# Altium project rocket_flight_logger_utilequ_pcb.PrjPcb
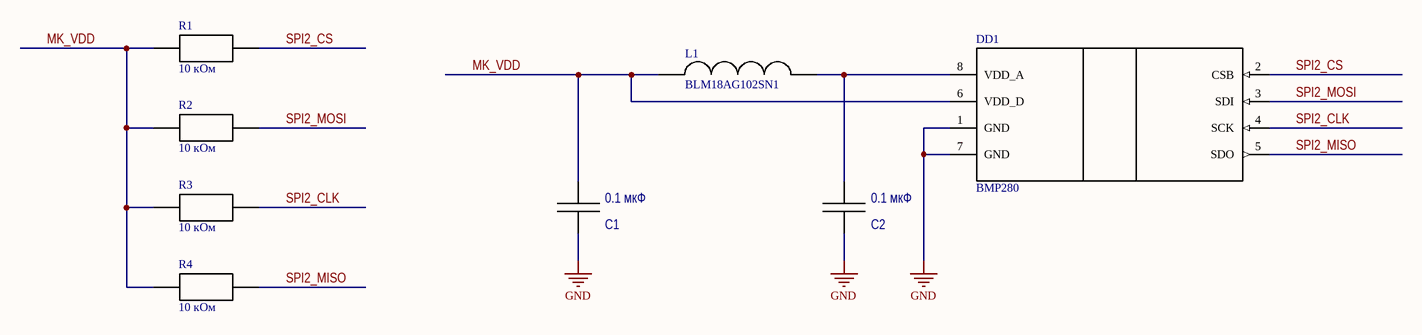
[diagram p0: BMP280.SchDoc]
8 sheets, 86 parts. Net scope: global (net labels, ports and power ports of the same name join across sheets).
Board file: main.PcbDoc
Sheets:
  BMP280.SchDoc
  CONNECT.SchDoc
  ESP12E.SchDoc
  FLASH.SchDoc
  MPU6050.SchDoc
  POWER.SchDoc
  PP.SchDoc
  STM32.SchDoc

## Sheet BMP280.SchDoc
size A4

### Parts
C1  0.1 мкФ  [C 1206]
C2  0.1 мкФ  [C 1206]
DD1  BMP280  [LGA_2.0_2.5_8PIN]
L1  BLM18AG102SN1  [FB 0603]
R1  10 кОм  [RES 0805]
R2  10 кОм  [RES 0805]
R3  10 кОм  [RES 0805]
R4  10 кОм  [RES 0805]

### Nets
GND: C1.2 C2.2 DD1.1(GND) DD1.7(GND)
MK_VDD: C1.1 DD1.6(VDD_D) L1.1 R1.1 R2.1 R3.1 R4.1
SPI2_CLK: DD1.4(SCK) R3.2
SPI2_CS: DD1.2(CSB) R1.2
SPI2_MISO: DD1.5(SDO) R4.2
SPI2_MOSI: DD1.3(SDI) R2.2
NetC2_1: C2.1 DD1.8(VDD_A) L1.2

### Library data of the parts
C1 C2 = CAP 1206: SMD Capacitor 1206; Manufacturer: /Укажите компанию-производителя/; Tolerance: /Укажите допуск в процентах/; Temperature coefficient: /Формат: ±? ppm/°C/; Type: Конденсатор керамический; TC: /Укажите тип диэлектрика/; Size: 1206; Temperature range: /Формат: -? ... ? °C/; Value: 0.1 мкФ
R1-R4 = RES 0805

## Sheet CONNECT.SchDoc
size A4
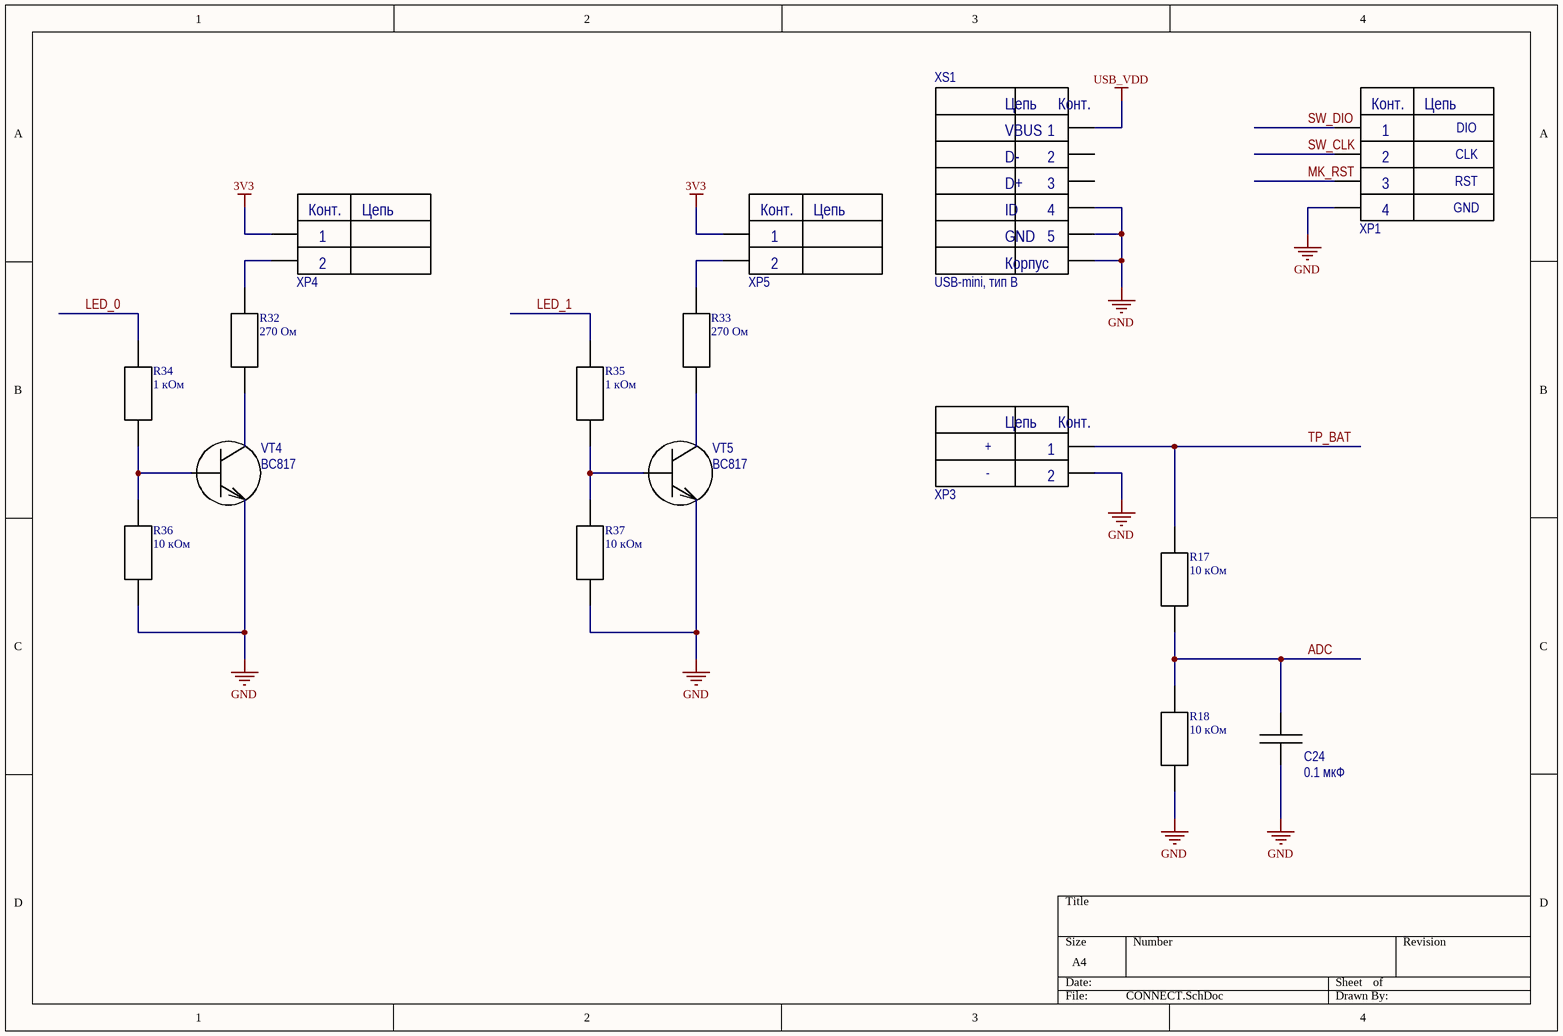
[diagram p1: CONNECT.SchDoc]

### Parts
C24  0.1 мкФ  [C 1206]
R17  10 кОм  [RES 0805]
R18  10 кОм  [RES 0805]
R32  270 Ом  [RES 0805]
R33  270 Ом  [RES 0805]
R34  1 кОм  [RES 0805]
R35  1 кОм  [RES 0805]
R36  10 кОм  [RES 0805]
R37  10 кОм  [RES 0805]
VT4  BC817  [SOT-23]
VT5  BC817  [SOT-23]
XP1  PLD-4  [PLD-4]  (value not drawn)
XP3  PLS-2  [PLS-2]  (value not drawn)
XP4  PLS-2  [PLS-2]  (value not drawn)
XP5  PLS-2  [PLS-2]  (value not drawn)
XS1  USB-mini, тип B  [USB_mini_B]

### Nets
3V3: XP4.1 XP5.1
GND: C24.2 R18.1 R36.2 R37.2 VT4.2(E) VT5.2(E) XP1.4 XP3.2 XS1.0 XS1.4(CASE) XS1.5(GND)
USB_VDD: XS1.1(VBUS)
ADC: C24.1 R17.1 R18.2
LED_0: R34.1
LED_1: R35.1
MK_RST: XP1.3
SW_CLK: XP1.2
SW_DIO: XP1.1
TP_BAT: R17.2 XP3.1
NetR32_1: R32.1 XP4.2
NetR32_2: R32.2 VT4.3(C)
NetR33_1: R33.1 XP5.2
NetR33_2: R33.2 VT5.3(C)
NetR34_2: R34.2 R36.1 VT4.1(B)
NetR35_2: R35.2 R37.1 VT5.1(B)

Not connected (* = marked no-connect by the designer): XS1 2(D-) 3(D+)

### Notes on the sheet
- DIO
- CLK
- RST
- GND
- +
- -
- (in symbol PLD-4) Конт.; Цепь
- (in symbol PLS-2) Цепь; Конт.
- (in symbol USB-mini_B) Цепь; Конт.; ID; Корпус

### Library data of the parts
C24 = CAP 1206: as C1 on sheet BMP280; Size: 1206; Temperature range: /Формат: -? ... ? °C/; Value: 0.1 мкФ
R17 R18 R32-R37 = RES 0805
VT4 VT5 = BC817: NPN general-purpose transistor; Manufacturer: NXP; Structure: n-p-n; Type: Транзистор биполярный; hFE: 160 ... 600; Max collector-emitter voltage: 45 В; Max collector-base voltage: 50 В; Max emitter-base voltage: 5 В; Max collector current: 0,5 А; Max collector peak current: 1 А; Power dissitipation: 0,25 Вт; fT: 100 МГц; Collector-emitter saturation voltage: 0,7 В; Base-emitter on voltage: 1,2 В; Specitication: ЭКБ ИП; Collector-base сapacitance: 3 пФ; Complement: BC807; Temperature range: -65 ... 150 °C
XP1 = PLD-4: PLD connector; Manufacturer: NONAME; Connector type: Вилка на плату; Number of contacts: 4; Type: Разъем штыревой
XP3-XP5 = PLS-2: PLS connector; Manufacturer: NONAME; Connector type: Вилка на плату; Number of contacts: 2; Type: Разъем штыревой
XS1 = USB-mini_B: USB-mini-B connector; Manufacturer: NONAME; Connector type: USB-mini, тип B на плату; Number of contacts: 5; Type: Разъем

## Sheet ESP12E.SchDoc
size A4
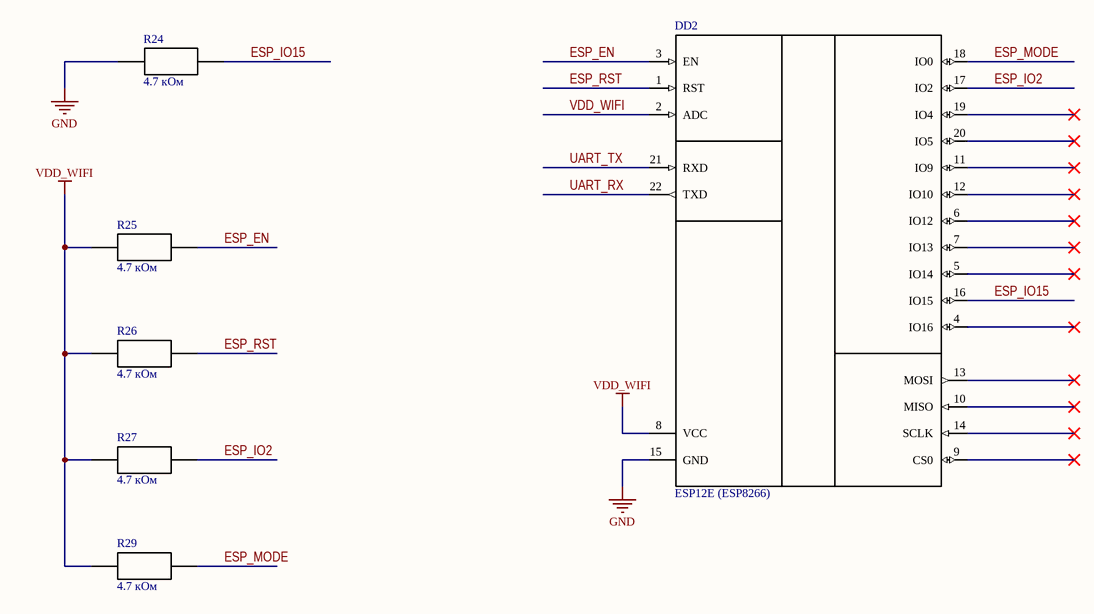
[diagram p2: ESP12E.SchDoc]

### Parts
DD2  ESP12E (ESP8266)  [ESP-12E]
R24  4.7 кОм  [RES 0805]
R25  4.7 кОм  [RES 0805]
R26  4.7 кОм  [RES 0805]
R27  4.7 кОм  [RES 0805]
R29  4.7 кОм  [RES 0805]

### Nets
GND: DD2.15(GND) R24.2
VDD_WIFI: DD2.2(ADC) DD2.8(VCC) R25.2 R26.2 R27.2 R29.2
ESP_EN: DD2.3(EN) R25.1
ESP_IO2: DD2.17(IO2) R27.1
ESP_IO15: DD2.16(IO15) R24.1
ESP_MODE: DD2.18(IO0) R29.1
ESP_RST: DD2.1(RST) R26.1
UART_RX: DD2.22(TXD)
UART_TX: DD2.21(RXD)

Not connected (* = marked no-connect by the designer): DD2 4(IO16)* 5(IO14)* 6(IO12)* 7(IO13)* 9(CS0)* 10(MISO)* 11(IO9)* 12(IO10)* 13(MOSI)* 14(SCLK)* 19(IO4)* 20(IO5)*

### Library data of the parts
R24-R27 R29 = RES 0805

## Sheet FLASH.SchDoc
size A4
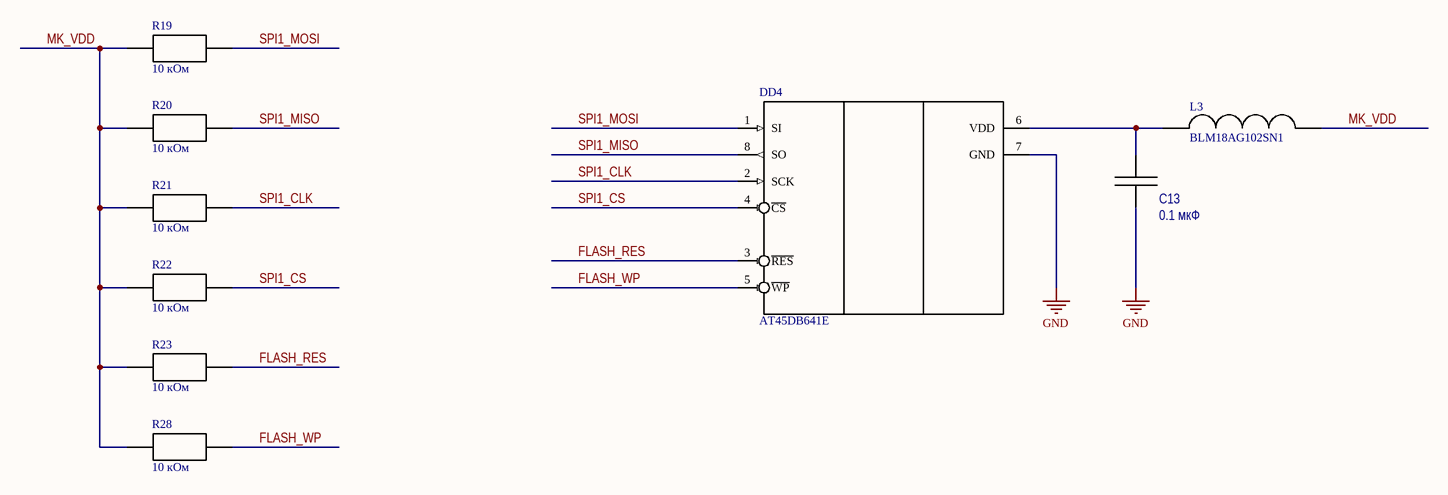
[diagram p3: FLASH.SchDoc]

### Parts
C13  0.1 мкФ  [C 1206]
DD4  AT45DB641E  [SOIC127P800X216-8N]
L3  BLM18AG102SN1  [FB 0603]
R19  10 кОм  [RES 0805]
R20  10 кОм  [RES 0805]
R21  10 кОм  [RES 0805]
R22  10 кОм  [RES 0805]
R23  10 кОм  [RES 0805]
R28  10 кОм  [RES 0805]

### Nets
GND: C13.2 DD4.7(GND)
MK_VDD: L3.2 R19.1 R20.1 R21.1 R22.1 R23.1 R28.1
FLASH_RES: DD4.3(~{RES}) R23.2
FLASH_WP: DD4.5(~{WP}) R28.2
SPI1_CLK: DD4.2(SCK) R21.2
SPI1_CS: DD4.4(~{CS}) R22.2
SPI1_MISO: DD4.8(SO) R20.2
SPI1_MOSI: DD4.1(SI) R19.2
NetC13_1: C13.1 DD4.6(VDD) L3.1

### Library data of the parts
C13 = CAP 1206: as C1 on sheet BMP280; Size: 1206; Temperature range: /Формат: -? ... ? °C/; Value: 0.1 мкФ
R19-R23 R28 = RES 0805

## Sheet MPU6050.SchDoc
size A4
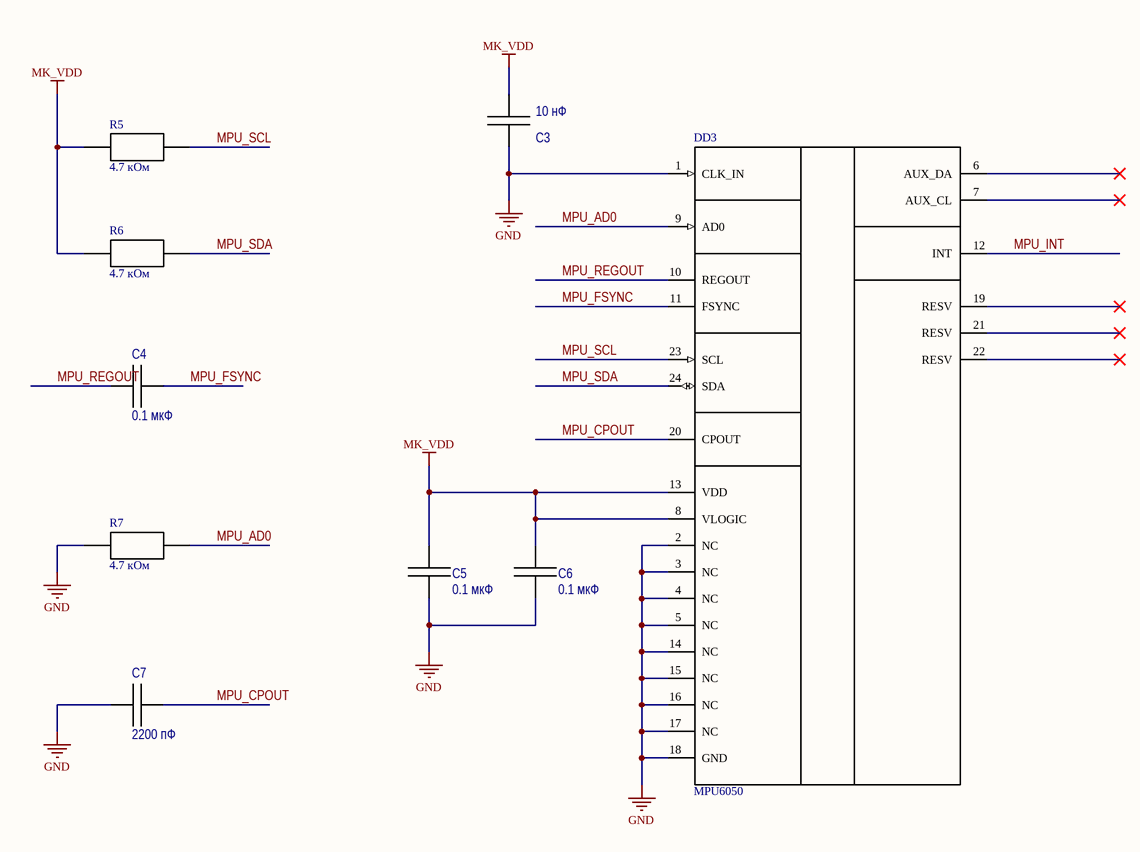
[diagram p4: MPU6050.SchDoc]

### Parts
C3  10 нФ  [C 1206]
C4  0.1 мкФ  [C 1206]
C5  0.1 мкФ  [C 1206]
C6  0.1 мкФ  [C 1206]
C7  2200 пФ  [C 1206]
DD3  MPU6050  [QFN50P400X400X95_HS-25N]
R5  4.7 кОм  [RES 0805]
R6  4.7 кОм  [RES 0805]
R7  4.7 кОм  [RES 0805]

### Nets
GND: C3.1 C5.2 C6.2 C7.1 DD3.1(CLK_IN) DD3.2(NC) DD3.3(NC) DD3.4(NC) DD3.5(NC) DD3.14(NC) DD3.15(NC) DD3.16(NC) DD3.17(NC) DD3.18(GND) R7.2
MK_VDD: C3.2 C5.1 C6.1 DD3.8(VLOGIC) DD3.13(VDD) R5.2 R6.2
MPU_AD0: DD3.9(AD0) R7.1
MPU_CPOUT: C7.2 DD3.20(CPOUT)
MPU_FSYNC: C4.2 DD3.11(FSYNC)
MPU_INT: DD3.12(INT)
MPU_REGOUT: C4.1 DD3.10(REGOUT)
MPU_SCL: DD3.23(SCL) R5.1
MPU_SDA: DD3.24(SDA) R6.1

Not connected (* = marked no-connect by the designer): DD3 6(AUX_DA)* 7(AUX_CL)* 19(RESV)* 21(RESV)* 22(RESV)*

### Library data of the parts
C3-C7 = CAP 1206: as C1 on sheet BMP280; Size: 1206; Temperature range: /Формат: -? ... ? °C/
R5-R7 = RES 0805

## Sheet POWER.SchDoc
size A4
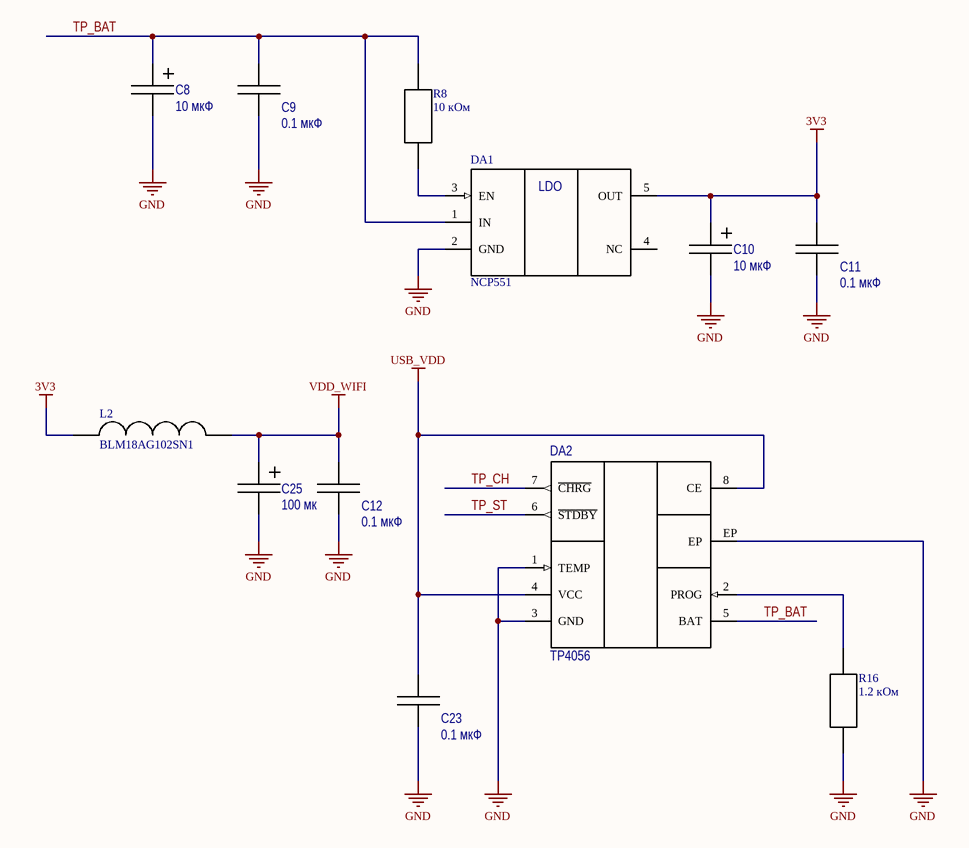
[diagram p5: POWER.SchDoc]

### Parts
C8  10 мкФ  [C TAN_C]
C9  0.1 мкФ  [C 1206]
C10  10 мкФ  [C TAN_C]
C11  0.1 мкФ  [C 1206]
C12  0.1 мкФ  [C 1206]
C23  0.1 мкФ  [C 1206]
C25  value 100 мк  [C TAN_D]
DA1  NCP551  [TSOP-5]
DA2  TP4056  [HSOP-8]
L2  BLM18AG102SN1  [FB 0603]
R8  10 кОм  [RES 0805]
R16  1.2 кОм  [RES 0805]

### Nets
3V3: C10.1 C11.1 DA1.5(OUT) L2.1
GND: C8.2 C9.2 C10.2 C11.2 C12.2 C23.2 C25.2 DA1.2(GND) DA2.1(TEMP) DA2.3(GND) DA2.EP R16.1
USB_VDD: C23.1 DA2.4(VCC) DA2.8(CE)
VDD_WIFI: C12.1 C25.1 L2.2
TP_BAT: C8.1 C9.1 DA1.1(IN) DA2.5(BAT) R8.2
TP_CH: DA2.7(~{CHRG})
TP_ST: DA2.6(~{STDBY})
NetDA1_3: DA1.3(EN) R8.1
NetDA2_2: DA2.2(PROG) R16.2

Not connected (* = marked no-connect by the designer): DA1 4(NC)

### Notes on the sheet
- (in symbol NCP551) LDO

### Library data of the parts
C8 C10 = CAP TAN_C: SMD Tantalium Capacitor C; Manufacturer: /Укажите компанию-производителя/; Tolerance: /Укажите допуск в процентах/; Type: Конденсатор танталовый; ESR: /Укажите значение ЭПС/; Size: C; Temperature range: /Формат: -? ... ? °C/; Value: 10 мкФ
C9 C11 C12 C23 = CAP 1206: as C1 on sheet BMP280; Size: 1206; Temperature range: /Формат: -? ... ? °C/; Value: 0.1 мкФ
C25 = CAP TAN_D: SMD Tantalium Capacitor D; Manufacturer: /Укажите компанию-производителя/; Tolerance: /Укажите допуск в процентах/; Type: Конденсатор танталовый; ESR: /Укажите значение ЭПС/; Rated voltage: 10 В; Size: D; Temperature range: /Формат: -? ... ? °C/
R8 R16 = RES 0805

## Sheet PP.SchDoc
size A4
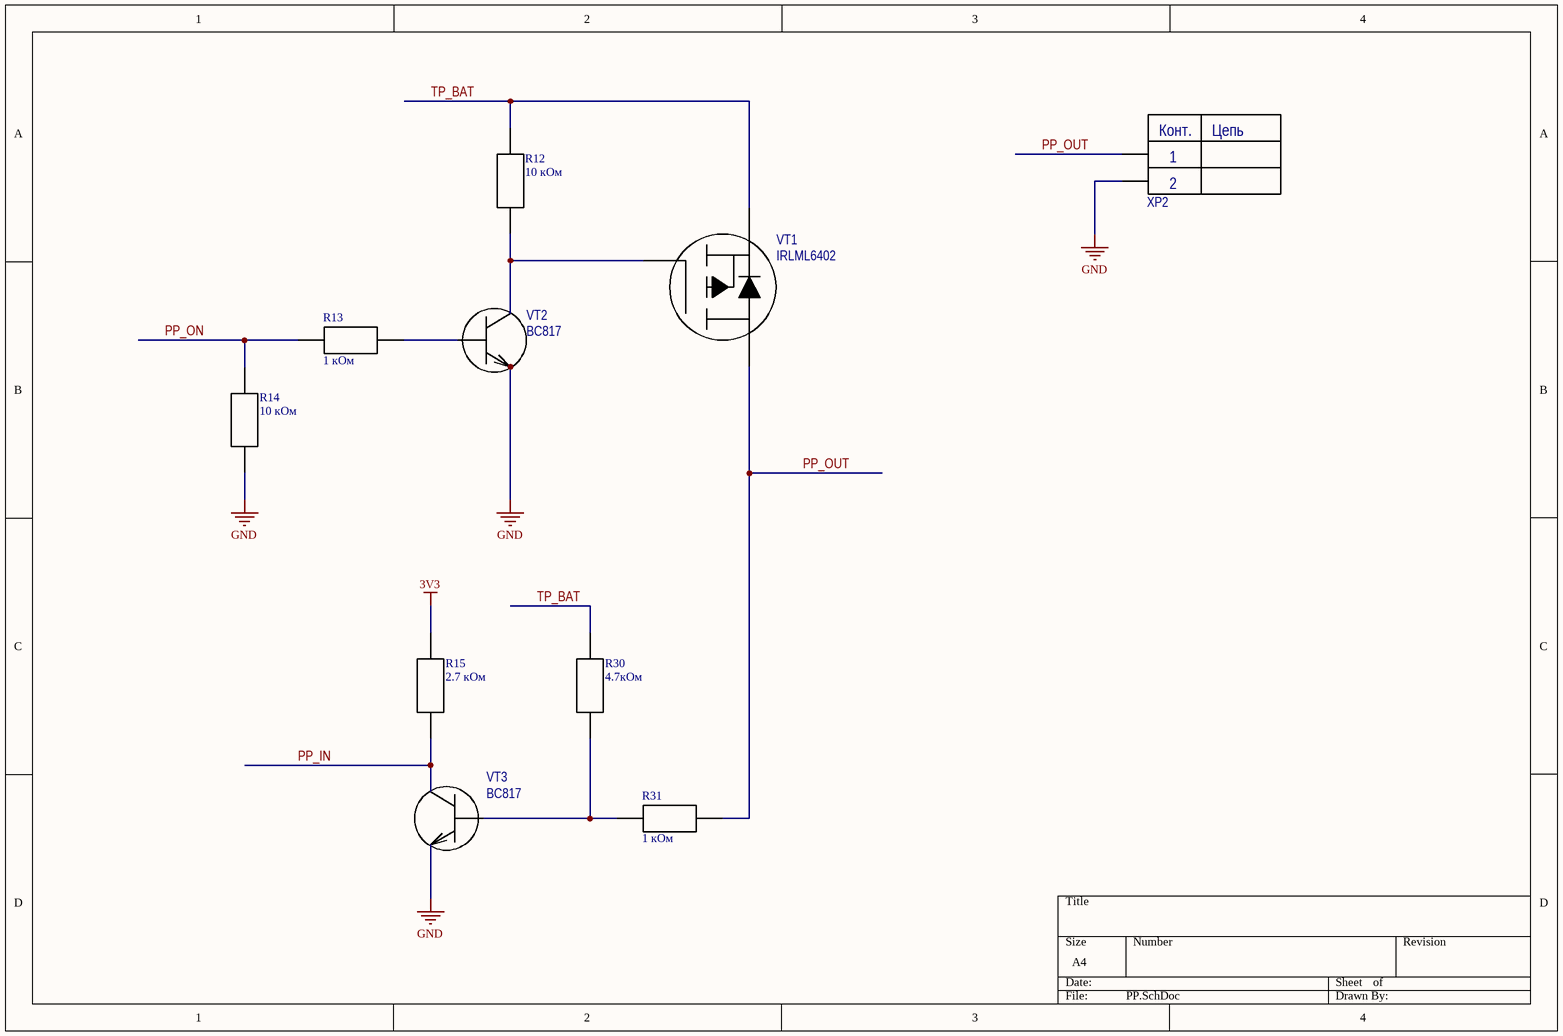
[diagram p6: PP.SchDoc]

### Parts
R12  10 кОм  [RES 0805]
R13  1 кОм  [RES 0805]
R14  10 кОм  [RES 0805]
R15  2.7 кОм  [RES 0805]
R30  4.7кОм  [RES 0805]
R31  1 кОм  [RES 0805]
VT1  IRLML6402  [SOT-23]
VT2  BC817  [SOT-23]
VT3  BC817  [SOT-23]
XP2  PLS-2  [PLS-2]  (value not drawn)

### Nets
3V3: R15.1
GND: R14.2 VT2.2(E) VT3.2(E) XP2.2
PP_IN: R15.2 VT3.3(C)
PP_ON: R13.2 R14.1
PP_OUT: R31.2 VT1.3(D) XP2.1
TP_BAT: R12.1 R30.1 VT1.2(S)
NetR12_2: R12.2 VT1.1(G) VT2.3(C)
NetR13_1: R13.1 VT2.1(B)
NetR30_2: R30.2 R31.1 VT3.1(B)

### Notes on the sheet
- (in symbol PLS-2) Конт.; Цепь

### Library data of the parts
R12-R15 R30 R31 = RES 0805
VT2 VT3 = BC817: as VT4 on sheet CONNECT; Temperature range: -65 ... 150 °C
XP2 = PLS-2: as XP3 on sheet CONNECT; Type: Разъем штыревой

## Sheet STM32.SchDoc
size OrCAD B
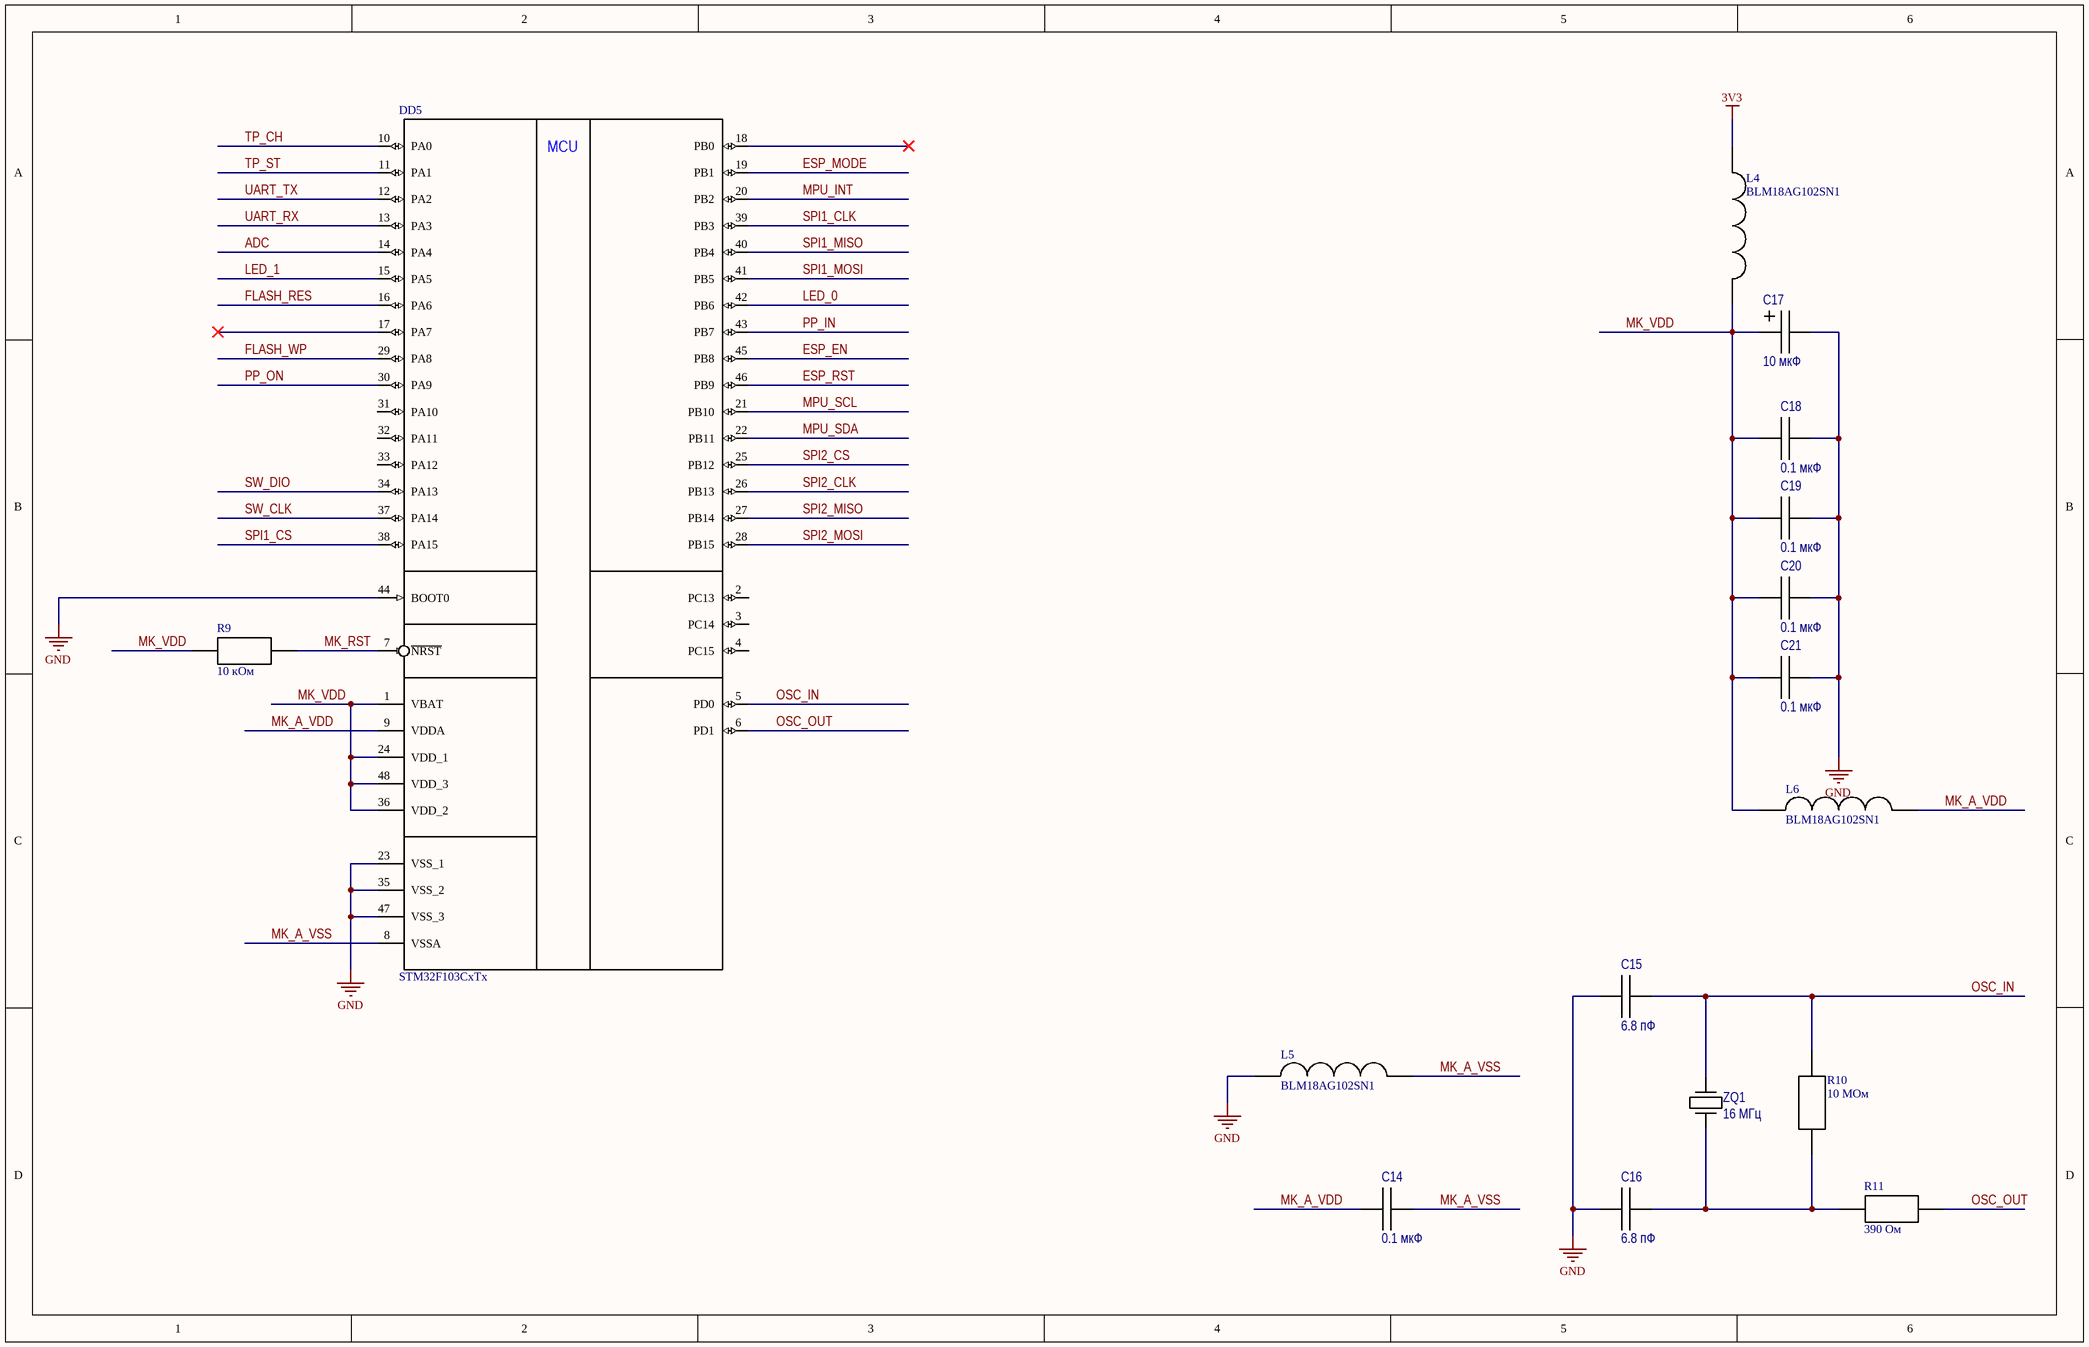
[diagram p7: STM32.SchDoc]

### Parts
C14  0.1 мкФ  [C 1206]
C15  6.8 пФ  [C 1206]
C16  6.8 пФ  [C 1206]
C17  10 мкФ  [C TAN_C]
C18  0.1 мкФ  [C 1206]
C19  0.1 мкФ  [C 1206]
C20  0.1 мкФ  [C 1206]
C21  0.1 мкФ  [C 1206]
DD5  STM32F103CxTx  [TSQFP50P900X900X160-48N]
L4  BLM18AG102SN1  [FB 0603]
L5  BLM18AG102SN1  [FB 0603]
L6  BLM18AG102SN1  [FB 0603]
R9  10 кОм  [RES 0805]
R10  10 МОм  [RES 0805]
R11  390 Ом  [RES 0805]
ZQ1  value 16 МГц  [NX3225SA]  (hidden comment: NX3225SA-16.000M-STD-CRS-2)

### Nets
3V3: L4.1
GND: C15.1 C16.1 C17.2 C18.2 C19.2 C20.2 C21.2 DD5.23(VSS_1) DD5.35(VSS_2) DD5.44(BOOT0) DD5.47(VSS_3) L5.1
MK_VDD: C17.1 C18.1 C19.1 C20.1 C21.1 DD5.1(VBAT) DD5.24(VDD_1) DD5.36(VDD_2) DD5.48(VDD_3) L4.2 L6.1 R9.2
ADC: DD5.14(PA4)
ESP_EN: DD5.45(PB8)
ESP_MODE: DD5.19(PB1)
ESP_RST: DD5.46(PB9)
FLASH_RES: DD5.16(PA6)
FLASH_WP: DD5.29(PA8)
LED_0: DD5.42(PB6)
LED_1: DD5.15(PA5)
MK_A_VDD: C14.1 DD5.9(VDDA) L6.2
MK_A_VSS: C14.2 DD5.8(VSSA) L5.2
MK_RST: DD5.7(~{NRST}) R9.1
MPU_INT: DD5.20(PB2)
MPU_SCL: DD5.21(PB10)
MPU_SDA: DD5.22(PB11)
OSC_IN: C15.2 DD5.5(PD0) R10.2 ZQ1.3(XO)
OSC_OUT: DD5.6(PD1) R11.2
PP_IN: DD5.43(PB7)
PP_ON: DD5.30(PA9)
SPI1_CLK: DD5.39(PB3)
SPI1_CS: DD5.38(PA15)
SPI1_MISO: DD5.40(PB4)
SPI1_MOSI: DD5.41(PB5)
SPI2_CLK: DD5.26(PB13)
SPI2_CS: DD5.25(PB12)
SPI2_MISO: DD5.27(PB14)
SPI2_MOSI: DD5.28(PB15)
SW_CLK: DD5.37(PA14)
SW_DIO: DD5.34(PA13)
TP_CH: DD5.10(PA0)
TP_ST: DD5.11(PA1)
UART_RX: DD5.13(PA3)
UART_TX: DD5.12(PA2)
NetC16_2: C16.2 R10.1 R11.1 ZQ1.1(XI)

Not connected (* = marked no-connect by the designer): DD5 2(PC13) 3(PC14) 4(PC15) 17(PA7)* 18(PB0)* 31(PA10) 32(PA11) 33(PA12); ZQ1 2(NC) 4(NC)

### Notes on the sheet
- (in symbol STM32F103CxTx) MCU

### Library data of the parts
C14-C16 C18-C21 = CAP 1206: as C1 on sheet BMP280; Size: 1206; Temperature range: /Формат: -? ... ? °C/
  C14 C18-C21: Value: 0.1 мкФ
  C15 C16: Value: 6.8 пФ
C17 = CAP TAN_C: as C8 on sheet POWER; Size: C; Temperature range: /Формат: -? ... ? °C/; Value: 10 мкФ
R9-R11 = RES 0805
ZQ1 = NX3225SA-16.000M-STD-CRS-2: QUARTZ CRYSTAL; Manufacturer: NDK; Load capacitance: 8 пФ; Frequency stability: ±15 ppm; Type: Кварцевый резонатор; Temperature range: -40 ... 125 °C

## Nets that join several sheets
3V3: CONNECT (XP4.1 XP5.1), POWER (C10.1 C11.1 DA1.5 L2.1), PP (R15.1), STM32 (L4.1)
GND: BMP280 (C1.2 C2.2 DD1.1 DD1.7), CONNECT (11 pins), ESP12E (DD2.15 R24.2), FLASH (C13.2 DD4.7), MPU6050 (15 pins), POWER (12 pins), PP (R14.2 VT2.2 VT3.2 XP2.2), STM32 (12 pins)
MK_VDD: BMP280 (7 pins), FLASH (7 pins), MPU6050 (7 pins), STM32 (12 pins)
USB_VDD: CONNECT (XS1.1), POWER (C23.1 DA2.4 DA2.8)
VDD_WIFI: ESP12E (6 pins), POWER (C12.1 C25.1 L2.2)
ADC: CONNECT (C24.1 R17.1 R18.2), STM32 (DD5.14)
ESP_EN: ESP12E (DD2.3 R25.1), STM32 (DD5.45)
ESP_MODE: ESP12E (DD2.18 R29.1), STM32 (DD5.19)
ESP_RST: ESP12E (DD2.1 R26.1), STM32 (DD5.46)
FLASH_RES: FLASH (DD4.3 R23.2), STM32 (DD5.16)
FLASH_WP: FLASH (DD4.5 R28.2), STM32 (DD5.29)
LED_0: CONNECT (R34.1), STM32 (DD5.42)
LED_1: CONNECT (R35.1), STM32 (DD5.15)
MK_RST: CONNECT (XP1.3), STM32 (DD5.7 R9.1)
MPU_INT: MPU6050 (DD3.12), STM32 (DD5.20)
MPU_SCL: MPU6050 (DD3.23 R5.1), STM32 (DD5.21)
MPU_SDA: MPU6050 (DD3.24 R6.1), STM32 (DD5.22)
PP_IN: PP (R15.2 VT3.3), STM32 (DD5.43)
PP_ON: PP (R13.2 R14.1), STM32 (DD5.30)
SPI1_CLK: FLASH (DD4.2 R21.2), STM32 (DD5.39)
SPI1_CS: FLASH (DD4.4 R22.2), STM32 (DD5.38)
SPI1_MISO: FLASH (DD4.8 R20.2), STM32 (DD5.40)
SPI1_MOSI: FLASH (DD4.1 R19.2), STM32 (DD5.41)
SPI2_CLK: BMP280 (DD1.4 R3.2), STM32 (DD5.26)
SPI2_CS: BMP280 (DD1.2 R1.2), STM32 (DD5.25)
SPI2_MISO: BMP280 (DD1.5 R4.2), STM32 (DD5.27)
SPI2_MOSI: BMP280 (DD1.3 R2.2), STM32 (DD5.28)
SW_CLK: CONNECT (XP1.2), STM32 (DD5.37)
SW_DIO: CONNECT (XP1.1), STM32 (DD5.34)
TP_BAT: CONNECT (R17.2 XP3.1), POWER (5 pins), PP (R12.1 R30.1 VT1.2)
TP_CH: POWER (DA2.7), STM32 (DD5.10)
TP_ST: POWER (DA2.6), STM32 (DD5.11)
UART_RX: ESP12E (DD2.22), STM32 (DD5.13)
UART_TX: ESP12E (DD2.21), STM32 (DD5.12)